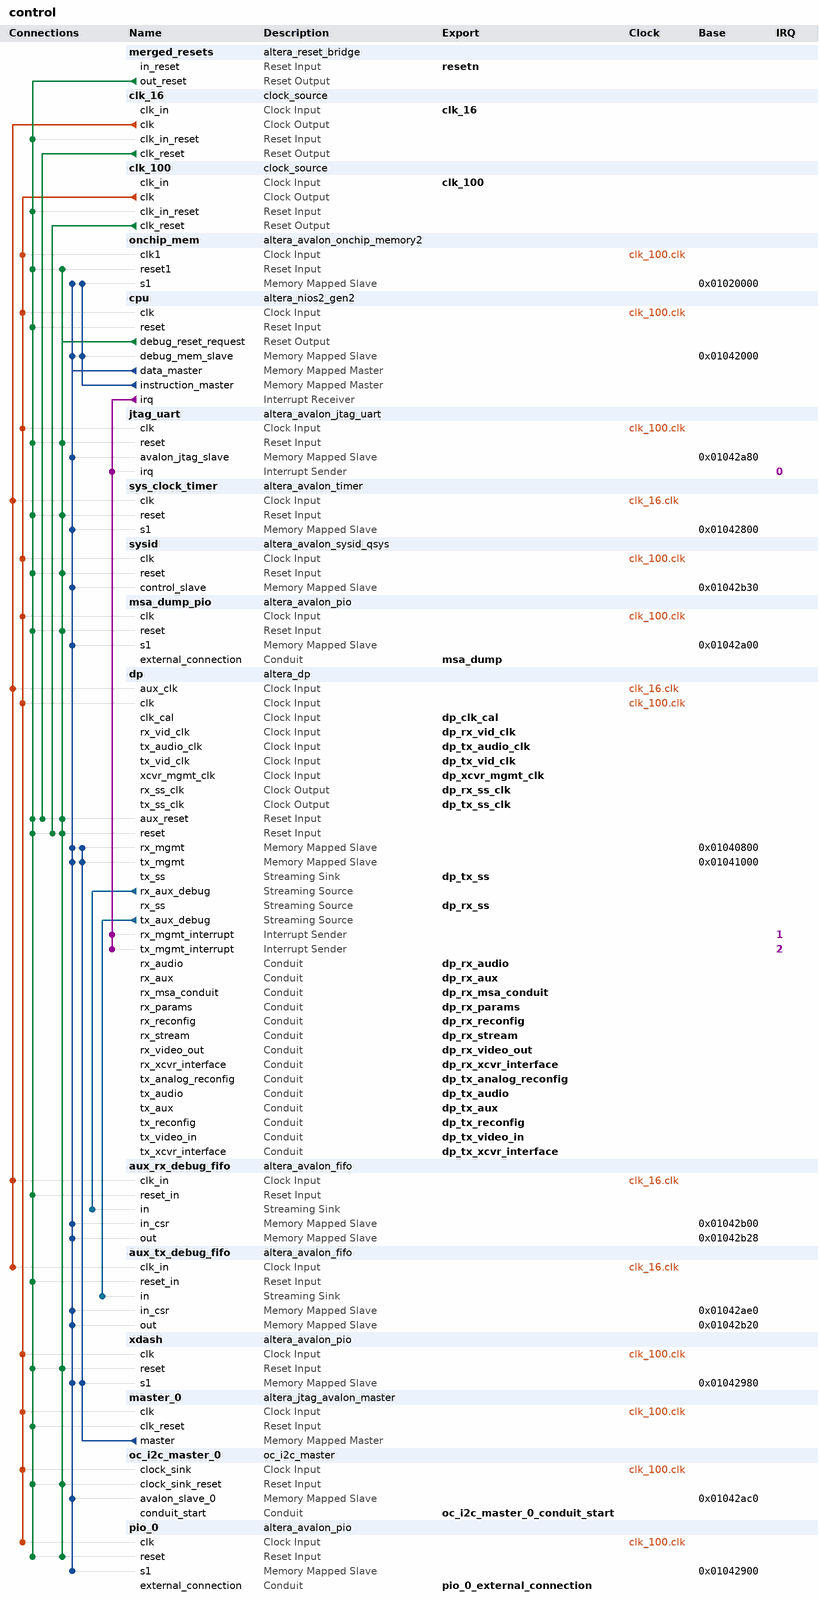
[diagram p0: system contents]
# Platform Designer (Qsys) system control, Stratix V 5SGXEA7K2F40C2
# Parameters at their usual value, and those the tool derives, are not listed.
package require -exact qsys 16.1
create_system control
set_project_property DEVICE_FAMILY {Stratix V}
set_project_property DEVICE 5SGXEA7K2F40C2

add_instance merged_resets altera_reset_bridge 16.1
set_instance_parameter_value merged_resets ACTIVE_LOW_RESET 1
set_instance_parameter_value merged_resets SYNCHRONOUS_EDGES none

add_instance clk_16 clock_source 16.1
set_instance_parameter_value clk_16 clockFrequency 16000000

add_instance clk_100 clock_source 16.1
set_instance_parameter_value clk_100 clockFrequency 100000000

add_instance onchip_mem altera_avalon_onchip_memory2 16.1
set_instance_parameter_value onchip_mem dataWidth 32
set_instance_parameter_value onchip_mem dualPort false
set_instance_parameter_value onchip_mem initMemContent true
set_instance_parameter_value onchip_mem initializationFileName control_onchip_mem
set_instance_parameter_value onchip_mem memorySize 131072
set_instance_parameter_value onchip_mem useNonDefaultInitFile true

add_instance cpu altera_nios2_gen2 16.1
set_instance_parameter_value cpu dcache_size 2048
set_instance_parameter_value cpu exceptionSlave onchip_mem.s1
set_instance_parameter_value cpu icache_size 2048
set_instance_parameter_value cpu impl Tiny
set_instance_parameter_value cpu resetSlave onchip_mem.s1
set_instance_parameter_value cpu setting_activateTrace true

add_instance jtag_uart altera_avalon_jtag_uart 16.1
set_instance_parameter_value jtag_uart readBufferDepth 1024
set_instance_parameter_value jtag_uart readIRQThreshold 1
set_instance_parameter_value jtag_uart simInteractiveOptions INTERACTIVE_ASCII_OUTPUT
set_instance_parameter_value jtag_uart writeBufferDepth 1024
set_instance_parameter_value jtag_uart writeIRQThreshold 1

add_instance sys_clock_timer altera_avalon_timer 16.1
set_instance_parameter_value sys_clock_timer period 1
set_instance_parameter_value sys_clock_timer periodUnits USEC

add_instance sysid altera_avalon_sysid_qsys 16.1
set_instance_parameter_value sysid id 0

add_instance msa_dump_pio altera_avalon_pio 16.1
set_instance_parameter_value msa_dump_pio direction Input
set_instance_parameter_value msa_dump_pio width 1

add_instance dp altera_dp 16.1
set_instance_parameter_value dp RX_AUDIO_CHANS 8
set_instance_parameter_value dp RX_AUX_DEBUG 1
set_instance_parameter_value dp RX_AUX_GPU 1
set_instance_parameter_value dp RX_EXPORT_MSA 1
set_instance_parameter_value dp RX_I2C_SCL_KHZ 100
set_instance_parameter_value dp RX_IEEE_OUI 1
set_instance_parameter_value dp RX_MAX_LANE_COUNT 4
set_instance_parameter_value dp RX_MAX_LINK_RATE 20
set_instance_parameter_value dp RX_MAX_NUM_OF_STREAMS 1
set_instance_parameter_value dp RX_PIXELS_PER_CLOCK 4
set_instance_parameter_value dp RX_SCRAMBLER_SEED 65535
set_instance_parameter_value dp RX_SUPPORT_AUDIO 1
set_instance_parameter_value dp RX_SUPPORT_AUTOMATED_TEST 1
set_instance_parameter_value dp RX_SUPPORT_DP 1
set_instance_parameter_value dp RX_SUPPORT_GTC 0
set_instance_parameter_value dp RX_SUPPORT_I2CMASTER 0
set_instance_parameter_value dp RX_SUPPORT_MST 0
set_instance_parameter_value dp RX_SUPPORT_SS 1
set_instance_parameter_value dp RX_SYMBOLS_PER_CLOCK 2
set_instance_parameter_value dp RX_VIDEO_BPS 16
set_instance_parameter_value dp TX_AUDIO_CHANS 8
set_instance_parameter_value dp TX_AUX_DEBUG 1
set_instance_parameter_value dp TX_MAX_LANE_COUNT 4
set_instance_parameter_value dp TX_MAX_LINK_RATE 20
set_instance_parameter_value dp TX_MAX_NUM_OF_STREAMS 1
set_instance_parameter_value dp TX_PIXELS_PER_CLOCK 4
set_instance_parameter_value dp TX_SCRAMBLER_SEED 65535
set_instance_parameter_value dp TX_SUPPORT_ANALOG_RECONFIG 1
set_instance_parameter_value dp TX_SUPPORT_AUDIO 1
set_instance_parameter_value dp TX_SUPPORT_AUTOMATED_TEST 1
set_instance_parameter_value dp TX_SUPPORT_DP 1
set_instance_parameter_value dp TX_SUPPORT_GTC 0
set_instance_parameter_value dp TX_SUPPORT_MST 0
set_instance_parameter_value dp TX_SUPPORT_SS 1
set_instance_parameter_value dp TX_SYMBOLS_PER_CLOCK 2
set_instance_parameter_value dp TX_VIDEO_BPS 16
set_instance_parameter_value dp device_family {Stratix V}

add_instance aux_rx_debug_fifo altera_avalon_fifo 16.1
set_instance_parameter_value aux_rx_debug_fifo bitsPerSymbol 32
set_instance_parameter_value aux_rx_debug_fifo channelWidth 1
set_instance_parameter_value aux_rx_debug_fifo errorWidth 1
set_instance_parameter_value aux_rx_debug_fifo fifoDepth 2048
set_instance_parameter_value aux_rx_debug_fifo fifoInputInterfaceOptions AVALONST_SINK
set_instance_parameter_value aux_rx_debug_fifo fifoOutputInterfaceOptions AVALONMM_READ
set_instance_parameter_value aux_rx_debug_fifo singleClockMode true
set_instance_parameter_value aux_rx_debug_fifo symbolsPerBeat 1
set_instance_parameter_value aux_rx_debug_fifo useBackpressure false
set_instance_parameter_value aux_rx_debug_fifo useIRQ false
set_instance_parameter_value aux_rx_debug_fifo usePacket true
set_instance_parameter_value aux_rx_debug_fifo useReadControl false

add_instance aux_tx_debug_fifo altera_avalon_fifo 16.1
set_instance_parameter_value aux_tx_debug_fifo bitsPerSymbol 32
set_instance_parameter_value aux_tx_debug_fifo channelWidth 1
set_instance_parameter_value aux_tx_debug_fifo errorWidth 1
set_instance_parameter_value aux_tx_debug_fifo fifoDepth 2048
set_instance_parameter_value aux_tx_debug_fifo fifoInputInterfaceOptions AVALONST_SINK
set_instance_parameter_value aux_tx_debug_fifo fifoOutputInterfaceOptions AVALONMM_READ
set_instance_parameter_value aux_tx_debug_fifo singleClockMode true
set_instance_parameter_value aux_tx_debug_fifo symbolsPerBeat 1
set_instance_parameter_value aux_tx_debug_fifo useBackpressure false
set_instance_parameter_value aux_tx_debug_fifo useIRQ false
set_instance_parameter_value aux_tx_debug_fifo usePacket true
set_instance_parameter_value aux_tx_debug_fifo useReadControl false

add_instance xdash altera_avalon_pio 16.1
set_instance_parameter_value xdash direction Output
set_instance_parameter_value xdash width 32

add_instance master_0 altera_jtag_avalon_master 16.1

add_instance oc_i2c_master_0 oc_i2c_master 1.0

add_instance pio_0 altera_avalon_pio 16.1
set_instance_parameter_value pio_0 direction Input
set_instance_parameter_value pio_0 width 1

# connections
add_connection clk_16.clk aux_rx_debug_fifo.clk_in clock
add_connection clk_16.clk aux_tx_debug_fifo.clk_in clock
add_connection clk_16.clk dp.aux_clk clock
add_connection clk_16.clk sys_clock_timer.clk clock
add_connection clk_100.clk cpu.clk clock
add_connection clk_100.clk dp.clk clock
add_connection clk_100.clk jtag_uart.clk clock
add_connection clk_100.clk master_0.clk clock
add_connection clk_100.clk msa_dump_pio.clk clock
add_connection clk_100.clk oc_i2c_master_0.clock_sink clock
add_connection clk_100.clk onchip_mem.clk1 clock
add_connection clk_100.clk pio_0.clk clock
add_connection clk_100.clk sysid.clk clock
add_connection clk_100.clk xdash.clk clock
add_connection clk_16.clk_reset dp.aux_reset reset
add_connection clk_100.clk_reset dp.reset reset
add_connection cpu.debug_reset_request dp.aux_reset reset
add_connection cpu.debug_reset_request dp.reset reset
add_connection cpu.debug_reset_request jtag_uart.reset reset
add_connection cpu.debug_reset_request msa_dump_pio.reset reset
add_connection cpu.debug_reset_request oc_i2c_master_0.clock_sink_reset reset
add_connection cpu.debug_reset_request onchip_mem.reset1 reset
add_connection cpu.debug_reset_request pio_0.reset reset
add_connection cpu.debug_reset_request sys_clock_timer.reset reset
add_connection cpu.debug_reset_request sysid.reset reset
add_connection cpu.debug_reset_request xdash.reset reset
add_connection merged_resets.out_reset aux_rx_debug_fifo.reset_in reset
add_connection merged_resets.out_reset aux_tx_debug_fifo.reset_in reset
add_connection merged_resets.out_reset clk_16.clk_in_reset reset
add_connection merged_resets.out_reset clk_100.clk_in_reset reset
add_connection merged_resets.out_reset cpu.reset reset
add_connection merged_resets.out_reset dp.aux_reset reset
add_connection merged_resets.out_reset dp.reset reset
add_connection merged_resets.out_reset jtag_uart.reset reset
add_connection merged_resets.out_reset master_0.clk_reset reset
add_connection merged_resets.out_reset msa_dump_pio.reset reset
add_connection merged_resets.out_reset oc_i2c_master_0.clock_sink_reset reset
add_connection merged_resets.out_reset onchip_mem.reset1 reset
add_connection merged_resets.out_reset pio_0.reset reset
add_connection merged_resets.out_reset sys_clock_timer.reset reset
add_connection merged_resets.out_reset sysid.reset reset
add_connection merged_resets.out_reset xdash.reset reset
add_connection cpu.data_master aux_rx_debug_fifo.in_csr avalon
set_connection_parameter_value cpu.data_master/aux_rx_debug_fifo.in_csr baseAddress 0x01042b00
add_connection cpu.data_master aux_rx_debug_fifo.out avalon
set_connection_parameter_value cpu.data_master/aux_rx_debug_fifo.out baseAddress 0x01042b28
add_connection cpu.data_master aux_tx_debug_fifo.in_csr avalon
set_connection_parameter_value cpu.data_master/aux_tx_debug_fifo.in_csr baseAddress 0x01042ae0
add_connection cpu.data_master aux_tx_debug_fifo.out avalon
set_connection_parameter_value cpu.data_master/aux_tx_debug_fifo.out baseAddress 0x01042b20
add_connection cpu.data_master cpu.debug_mem_slave avalon
set_connection_parameter_value cpu.data_master/cpu.debug_mem_slave baseAddress 0x01042000
add_connection cpu.data_master dp.rx_mgmt avalon
set_connection_parameter_value cpu.data_master/dp.rx_mgmt baseAddress 0x01040800
add_connection cpu.data_master dp.tx_mgmt avalon
set_connection_parameter_value cpu.data_master/dp.tx_mgmt baseAddress 0x01041000
add_connection cpu.data_master jtag_uart.avalon_jtag_slave avalon
set_connection_parameter_value cpu.data_master/jtag_uart.avalon_jtag_slave baseAddress 0x01042a80
add_connection cpu.data_master msa_dump_pio.s1 avalon
set_connection_parameter_value cpu.data_master/msa_dump_pio.s1 baseAddress 0x01042a00
add_connection cpu.data_master oc_i2c_master_0.avalon_slave_0 avalon
set_connection_parameter_value cpu.data_master/oc_i2c_master_0.avalon_slave_0 baseAddress 0x01042ac0
add_connection cpu.data_master onchip_mem.s1 avalon
set_connection_parameter_value cpu.data_master/onchip_mem.s1 baseAddress 0x01020000
add_connection cpu.data_master pio_0.s1 avalon
set_connection_parameter_value cpu.data_master/pio_0.s1 baseAddress 0x01042900
add_connection cpu.data_master sys_clock_timer.s1 avalon
set_connection_parameter_value cpu.data_master/sys_clock_timer.s1 baseAddress 0x01042800
add_connection cpu.data_master sysid.control_slave avalon
set_connection_parameter_value cpu.data_master/sysid.control_slave baseAddress 0x01042b30
add_connection cpu.data_master xdash.s1 avalon
set_connection_parameter_value cpu.data_master/xdash.s1 baseAddress 0x01042980
add_connection cpu.instruction_master cpu.debug_mem_slave avalon
set_connection_parameter_value cpu.instruction_master/cpu.debug_mem_slave baseAddress 0x01042000
add_connection cpu.instruction_master onchip_mem.s1 avalon
set_connection_parameter_value cpu.instruction_master/onchip_mem.s1 baseAddress 0x01020000
add_connection master_0.master dp.rx_mgmt avalon
set_connection_parameter_value master_0.master/dp.rx_mgmt baseAddress 0x01040800
add_connection master_0.master dp.tx_mgmt avalon
set_connection_parameter_value master_0.master/dp.tx_mgmt baseAddress 0x01041000
add_connection master_0.master xdash.s1 avalon
set_connection_parameter_value master_0.master/xdash.s1 baseAddress 0x01042980
add_connection dp.rx_aux_debug aux_rx_debug_fifo.in avalon_streaming
add_connection dp.tx_aux_debug aux_tx_debug_fifo.in avalon_streaming
add_connection cpu.irq dp.rx_mgmt_interrupt interrupt
set_connection_parameter_value cpu.irq/dp.rx_mgmt_interrupt irqNumber 1
add_connection cpu.irq dp.tx_mgmt_interrupt interrupt
set_connection_parameter_value cpu.irq/dp.tx_mgmt_interrupt irqNumber 2
add_connection cpu.irq jtag_uart.irq interrupt
set_connection_parameter_value cpu.irq/jtag_uart.irq irqNumber 0

# exported interfaces
add_interface clk_100 clock sink
set_interface_property clk_100 EXPORT_OF clk_100.clk_in
add_interface clk_16 clock sink
set_interface_property clk_16 EXPORT_OF clk_16.clk_in
add_interface dp_clk_cal clock sink
set_interface_property dp_clk_cal EXPORT_OF dp.clk_cal
add_interface dp_rx_audio conduit end
set_interface_property dp_rx_audio EXPORT_OF dp.rx_audio
add_interface dp_rx_aux conduit end
set_interface_property dp_rx_aux EXPORT_OF dp.rx_aux
add_interface dp_rx_msa_conduit conduit end
set_interface_property dp_rx_msa_conduit EXPORT_OF dp.rx_msa_conduit
add_interface dp_rx_params conduit end
set_interface_property dp_rx_params EXPORT_OF dp.rx_params
add_interface dp_rx_reconfig conduit end
set_interface_property dp_rx_reconfig EXPORT_OF dp.rx_reconfig
add_interface dp_rx_ss avalon_streaming source
set_interface_property dp_rx_ss EXPORT_OF dp.rx_ss
add_interface dp_rx_ss_clk clock source
set_interface_property dp_rx_ss_clk EXPORT_OF dp.rx_ss_clk
add_interface dp_rx_stream conduit end
set_interface_property dp_rx_stream EXPORT_OF dp.rx_stream
add_interface dp_rx_vid_clk clock sink
set_interface_property dp_rx_vid_clk EXPORT_OF dp.rx_vid_clk
add_interface dp_rx_video_out conduit end
set_interface_property dp_rx_video_out EXPORT_OF dp.rx_video_out
add_interface dp_rx_xcvr_interface conduit end
set_interface_property dp_rx_xcvr_interface EXPORT_OF dp.rx_xcvr_interface
add_interface dp_tx_analog_reconfig conduit end
set_interface_property dp_tx_analog_reconfig EXPORT_OF dp.tx_analog_reconfig
add_interface dp_tx_audio conduit end
set_interface_property dp_tx_audio EXPORT_OF dp.tx_audio
add_interface dp_tx_audio_clk clock sink
set_interface_property dp_tx_audio_clk EXPORT_OF dp.tx_audio_clk
add_interface dp_tx_aux conduit end
set_interface_property dp_tx_aux EXPORT_OF dp.tx_aux
add_interface dp_tx_reconfig conduit end
set_interface_property dp_tx_reconfig EXPORT_OF dp.tx_reconfig
add_interface dp_tx_ss avalon_streaming sink
set_interface_property dp_tx_ss EXPORT_OF dp.tx_ss
add_interface dp_tx_ss_clk clock source
set_interface_property dp_tx_ss_clk EXPORT_OF dp.tx_ss_clk
add_interface dp_tx_vid_clk clock sink
set_interface_property dp_tx_vid_clk EXPORT_OF dp.tx_vid_clk
add_interface dp_tx_video_in conduit end
set_interface_property dp_tx_video_in EXPORT_OF dp.tx_video_in
add_interface dp_tx_xcvr_interface conduit end
set_interface_property dp_tx_xcvr_interface EXPORT_OF dp.tx_xcvr_interface
add_interface dp_xcvr_mgmt_clk clock sink
set_interface_property dp_xcvr_mgmt_clk EXPORT_OF dp.xcvr_mgmt_clk
add_interface msa_dump conduit end
set_interface_property msa_dump EXPORT_OF msa_dump_pio.external_connection
add_interface oc_i2c_master_0_conduit_start conduit end
set_interface_property oc_i2c_master_0_conduit_start EXPORT_OF oc_i2c_master_0.conduit_start
add_interface pio_0_external_connection conduit end
set_interface_property pio_0_external_connection EXPORT_OF pio_0.external_connection
add_interface resetn reset sink
set_interface_property resetn EXPORT_OF merged_resets.in_reset

set_interconnect_requirement {$system} qsys_mm.clockCrossingAdapter HANDSHAKE
set_interconnect_requirement {$system} qsys_mm.maxAdditionalLatency 1

save_system control.qsys
